# Altium schematic sheet GeckoBreakout.SchDoc
size A
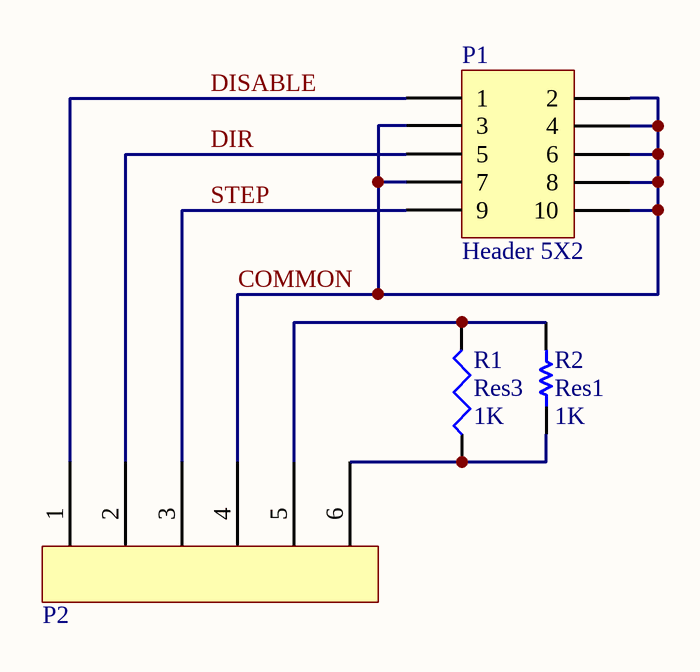
[diagram p0: GeckoBreakout.SchDoc]

## Parts
P1  Header 5X2  [BETTER HDR2X5]
P2  Phoenix_1933228  [Phoenix_1933228]  (value not drawn)
R1  Res3  value 1K  [3216[1206]]
R2  Res1  value 1K  [AXIAL-0.4]

## Nets
COMMON: P1.2 P1.3 P1.4 P1.6 P1.7 P1.8 P1.10 P2.4
DIR: P1.5 P2.2
DISABLE: P1.1 P2.1
STEP: P1.9 P2.3
NetP2_5: P2.5 R1.2 R2.2
NetP2_6: P2.6 R1.1 R2.1

## Library data of the parts
P1 = Header 5X2: Header, 5-Pin, Dual row; LatestRevisionDate: 17-Jul-2002; LatestRevisionNote: Re-released for DXP Platform.; Publisher: Altium Limited
R1 = Res3: Resistor; Published: 8-Jun-2000; LatestRevisionDate: 04-Mar-2005; LatestRevisionNote: PCB Footprint replaced.; PackageReference: J1-0603; Publisher: Altium Limited
R2 = Res1: Resistor; Published: 8-Jun-2000; LatestRevisionDate: 17-Jul-2002; LatestRevisionNote: Re-released for DXP Platform.; PackageReference: AXIAL-0.3; Publisher: Altium Limited